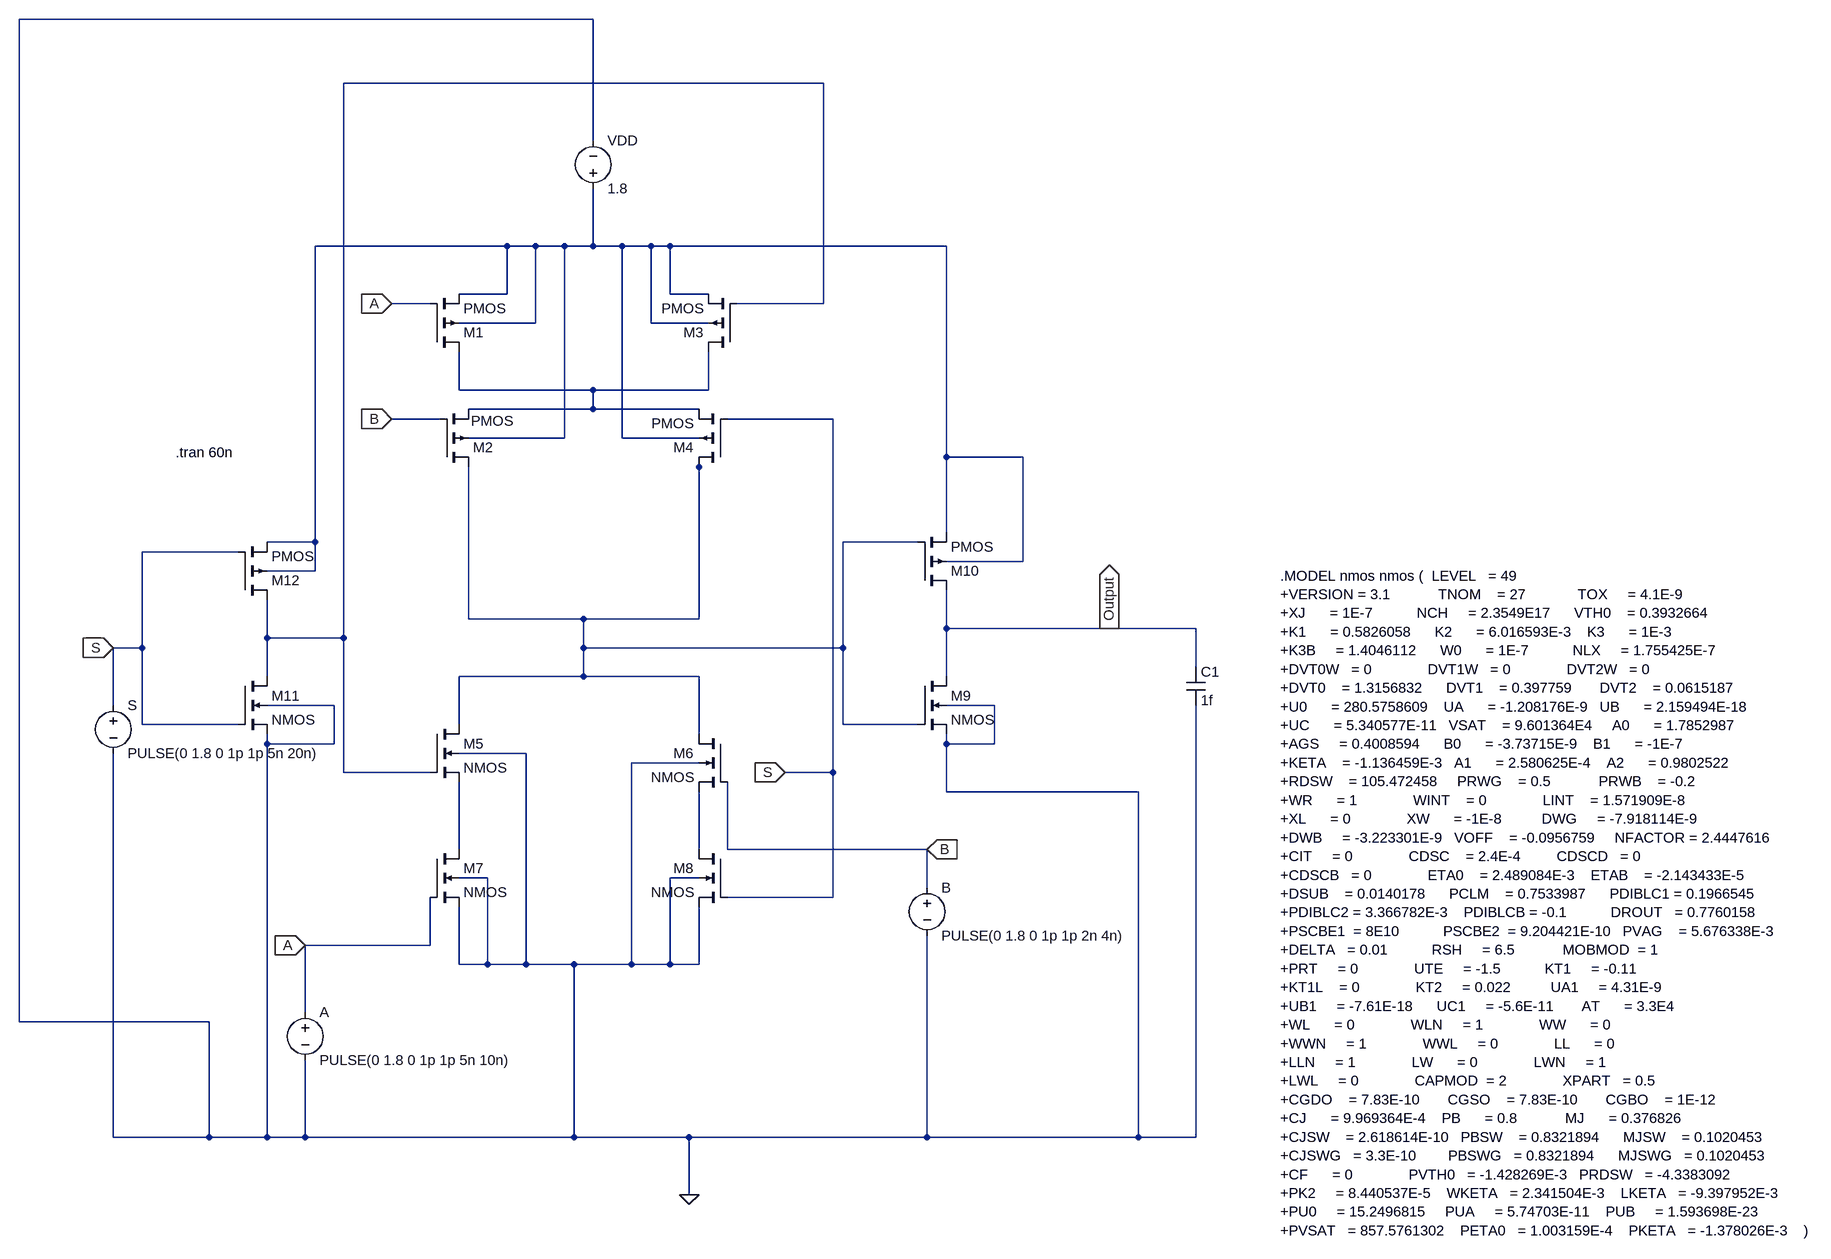
[diagram p0: schematic 2x1 MUX.asc]
2x1 MUX.asc, the LTspice schematic file:
Version 4
SHEET 1 2604 1684
WIRE 272 -336 -800 -336
WIRE 656 -208 -144 -208
WIRE 272 -112 272 -336
WIRE 128 64 -192 64
WIRE 176 64 128 64
WIRE 224 64 176 64
WIRE 272 64 272 -32
WIRE 272 64 224 64
WIRE 320 64 272 64
WIRE 368 64 320 64
WIRE 400 64 368 64
WIRE 864 64 400 64
WIRE 128 144 128 64
WIRE 128 144 48 144
WIRE 400 144 400 64
WIRE 464 144 400 144
WIRE 0 160 -64 160
WIRE 656 160 656 -208
WIRE 656 160 512 160
WIRE 176 192 176 64
WIRE 176 192 48 192
WIRE 368 192 368 64
WIRE 464 192 368 192
WIRE 48 304 48 240
WIRE 272 304 48 304
WIRE 464 304 464 240
WIRE 464 304 272 304
WIRE 272 336 272 304
WIRE 272 336 64 336
WIRE 448 336 272 336
WIRE 16 352 -64 352
WIRE 672 352 496 352
WIRE 224 384 224 64
WIRE 224 384 64 384
WIRE 320 384 320 64
WIRE 448 384 320 384
WIRE 864 416 864 64
WIRE 992 416 864 416
WIRE 448 432 448 416
WIRE 864 560 864 416
WIRE -192 576 -192 64
WIRE -192 576 -272 576
WIRE 816 576 688 576
WIRE -320 592 -480 592
WIRE 992 608 992 416
WIRE 992 608 864 608
WIRE -192 624 -192 576
WIRE -192 624 -272 624
WIRE 64 704 64 432
WIRE 256 704 64 704
WIRE 448 704 448 432
WIRE 448 704 256 704
WIRE 864 720 864 656
WIRE 1136 720 864 720
WIRE 1280 720 1136 720
WIRE -272 736 -272 672
WIRE -144 736 -144 -208
WIRE -144 736 -272 736
WIRE -480 752 -480 592
WIRE -480 752 -528 752
WIRE 256 752 256 704
WIRE 688 752 688 576
WIRE 688 752 256 752
WIRE 1280 784 1280 720
WIRE -272 800 -272 736
WIRE 256 800 256 752
WIRE 256 800 48 800
WIRE 448 800 256 800
WIRE 864 800 864 720
WIRE -528 848 -528 752
WIRE -160 848 -272 848
WIRE 944 848 864 848
WIRE -480 880 -480 752
WIRE -320 880 -480 880
WIRE 48 880 48 800
WIRE 688 880 688 752
WIRE 816 880 688 880
WIRE 448 896 448 800
WIRE -272 912 -272 896
WIRE -160 912 -160 848
WIRE -160 912 -272 912
WIRE 864 912 864 896
WIRE 944 912 944 848
WIRE 944 912 864 912
WIRE 160 928 48 928
WIRE 448 944 336 944
WIRE -144 960 -144 736
WIRE 0 960 -144 960
WIRE 672 960 672 352
WIRE 672 960 592 960
WIRE 864 992 864 912
WIRE 1184 992 864 992
WIRE 48 1088 48 976
WIRE 448 1088 448 992
WIRE 496 1088 496 976
WIRE 832 1088 496 1088
WIRE 96 1136 48 1136
WIRE 448 1136 400 1136
WIRE 832 1152 832 1088
WIRE 672 1168 672 960
WIRE 672 1168 496 1168
WIRE 0 1248 0 1168
WIRE 0 1248 -208 1248
WIRE 48 1280 48 1184
WIRE 96 1280 96 1136
WIRE 96 1280 48 1280
WIRE 160 1280 160 928
WIRE 160 1280 96 1280
WIRE 240 1280 160 1280
WIRE 336 1280 336 944
WIRE 336 1280 240 1280
WIRE 400 1280 400 1136
WIRE 400 1280 336 1280
WIRE 448 1280 448 1184
WIRE 448 1280 400 1280
WIRE -208 1360 -208 1248
WIRE -800 1376 -800 -336
WIRE -368 1376 -800 1376
WIRE -528 1568 -528 928
WIRE -368 1568 -368 1376
WIRE -368 1568 -528 1568
WIRE -272 1568 -272 912
WIRE -272 1568 -368 1568
WIRE -208 1568 -208 1440
WIRE -208 1568 -272 1568
WIRE 240 1568 240 1280
WIRE 240 1568 -208 1568
WIRE 432 1568 240 1568
WIRE 832 1568 832 1232
WIRE 832 1568 432 1568
WIRE 1184 1568 1184 992
WIRE 1184 1568 832 1568
WIRE 1280 1568 1280 848
WIRE 1280 1568 1184 1568
WIRE 432 1664 432 1568
FLAG -64 352 B
IOPIN -64 352 In
FLAG -64 160 A
IOPIN -64 160 In
FLAG -528 752 S
IOPIN -528 752 In
FLAG 592 960 S
IOPIN 592 960 In
FLAG 832 1088 B
IOPIN 832 1088 In
FLAG 1136 720 Output
IOPIN 1136 720 Out
FLAG -208 1248 A
IOPIN -208 1248 In
FLAG 432 1664 0
SYMBOL voltage 272 -16 M180
WINDOW 0 24 96 Left 2
WINDOW 3 24 16 Left 2
WINDOW 123 0 0 Left 0
WINDOW 39 0 0 Left 0
SYMATTR InstName VDD
SYMATTR Value 1.8
SYMBOL pmos4 0 240 M180
SYMATTR InstName M1
SYMATTR Value2 l=180n w=360n
SYMBOL pmos4 512 240 R180
SYMATTR InstName M3
SYMATTR Value2 l=180n w=360n
SYMBOL pmos4 16 432 M180
WINDOW 3 52 76 Left 2
SYMATTR InstName M2
SYMATTR Value2 l=180n w=360n
SYMBOL pmos4 496 432 R180
SYMATTR InstName M4
SYMATTR Value2 l=180n w=360n
SYMBOL nmos4 0 880 R0
SYMATTR InstName M5
SYMATTR Value2 l=180n w=360n
SYMBOL nmos4 496 896 M0
SYMATTR InstName M6
SYMATTR Value2 l=180n w=360n
SYMBOL nmos4 0 1088 R0
SYMATTR InstName M7
SYMATTR Value2 l=180n w=360n
SYMBOL nmos4 496 1088 M0
SYMATTR InstName M8
SYMATTR Value2 l=180n w=360n
SYMBOL nmos4 816 800 R0
SYMATTR InstName M9
SYMATTR Value2 l=180n w=360n
SYMBOL pmos4 816 656 M180
SYMATTR InstName M10
SYMATTR Value2 l=180n w=360n
SYMBOL pmos4 -320 672 M180
SYMATTR InstName M12
SYMATTR Value2 l=180n w=360n
SYMBOL nmos4 -320 800 R0
SYMATTR InstName M11
SYMATTR Value2 l=180n w=360n
SYMBOL voltage 832 1136 R0
WINDOW 123 0 0 Left 0
WINDOW 39 0 0 Left 0
SYMATTR InstName B
SYMATTR Value PULSE(0 1.8 0 1p 1p 2n 4n)
SYMBOL voltage -528 832 R0
WINDOW 123 0 0 Left 0
WINDOW 39 0 0 Left 0
SYMATTR InstName S
SYMATTR Value PULSE(0 1.8 0 1p 1p 5n 20n)
SYMBOL voltage -208 1344 R0
WINDOW 123 0 0 Left 0
WINDOW 39 0 0 Left 0
SYMATTR InstName A
SYMATTR Value PULSE(0 1.8 0 1p 1p 5n 10n)
SYMBOL cap 1264 784 R0
SYMATTR InstName C1
SYMATTR Value 1f
TEXT -424 408 Left 2 !.tran 60n
TEXT 1664 632 Left 2 !.MODEL nmos nmos (  LEVEL   = 49\n+VERSION = 3.1            TNOM    = 27             TOX     = 4.1E-9\n+XJ      = 1E-7           NCH     = 2.3549E17      VTH0    = 0.3932664\n+K1      = 0.5826058      K2      = 6.016593E-3    K3      = 1E-3\n+K3B     = 1.4046112      W0      = 1E-7           NLX     = 1.755425E-7\n+DVT0W   = 0              DVT1W   = 0              DVT2W   = 0\n+DVT0    = 1.3156832      DVT1    = 0.397759       DVT2    = 0.0615187\n+U0      = 280.5758609    UA      = -1.208176E-9   UB      = 2.159494E-18\n+UC      = 5.340577E-11   VSAT    = 9.601364E4     A0      = 1.7852987\n+AGS     = 0.4008594      B0      = -3.73715E-9    B1      = -1E-7\n+KETA    = -1.136459E-3   A1      = 2.580625E-4    A2      = 0.9802522\n+RDSW    = 105.472458     PRWG    = 0.5            PRWB    = -0.2\n+WR      = 1              WINT    = 0              LINT    = 1.571909E-8\n+XL      = 0              XW      = -1E-8          DWG     = -7.918114E-9\n+DWB     = -3.223301E-9   VOFF    = -0.0956759     NFACTOR = 2.4447616\n+CIT     = 0              CDSC    = 2.4E-4         CDSCD   = 0\n+CDSCB   = 0              ETA0    = 2.489084E-3    ETAB    = -2.143433E-5\n+DSUB    = 0.0140178      PCLM    = 0.7533987      PDIBLC1 = 0.1966545\n+PDIBLC2 = 3.366782E-3    PDIBLCB = -0.1           DROUT   = 0.7760158\n+PSCBE1  = 8E10           PSCBE2  = 9.204421E-10   PVAG    = 5.676338E-3\n+DELTA   = 0.01           RSH     = 6.5            MOBMOD  = 1\n+PRT     = 0              UTE     = -1.5           KT1     = -0.11\n+KT1L    = 0              KT2     = 0.022          UA1     = 4.31E-9\n+UB1     = -7.61E-18      UC1     = -5.6E-11       AT      = 3.3E4\n+WL      = 0              WLN     = 1              WW      = 0\n+WWN     = 1              WWL     = 0              LL      = 0\n+LLN     = 1              LW      = 0              LWN     = 1\n+LWL     = 0              CAPMOD  = 2              XPART   = 0.5\n+CGDO    = 7.83E-10       CGSO    = 7.83E-10       CGBO    = 1E-12\n+CJ      = 9.969364E-4    PB      = 0.8            MJ      = 0.376826\n+CJSW    = 2.618614E-10   PBSW    = 0.8321894      MJSW    = 0.1020453\n+CJSWG   = 3.3E-10        PBSWG   = 0.8321894      MJSWG   = 0.1020453\n+CF      = 0              PVTH0   = -1.428269E-3   PRDSW   = -4.3383092\n+PK2     = 8.440537E-5    WKETA   = 2.341504E-3    LKETA   = -9.397952E-3\n+PU0     = 15.2496815     PUA     = 5.74703E-11    PUB     = 1.593698E-23\n+PVSAT   = 857.5761302    PETA0   = 1.003159E-4    PKETA   = -1.378026E-3    )

The netlist it stands for:
* 2x1 MUX.asc
VDD N002 0 1.8
M1 N003 A N002 N002 PMOS l=180n w=360n
M3 N003 N001 N002 N002 PMOS l=180n w=360n
M2 N004 B N003 N002 PMOS l=180n w=360n
M4 N004 S N003 N002 PMOS l=180n w=360n
M5 N004 N001 N005 0 NMOS l=180n w=360n
M6 N004 B N006 0 NMOS l=180n w=360n
M7 N005 A 0 0 NMOS l=180n w=360n
M8 N006 S 0 0 NMOS l=180n w=360n
M9 Output N004 0 0 NMOS l=180n w=360n
M10 Output N004 N002 N002 PMOS l=180n w=360n
M12 N001 S N002 N002 PMOS l=180n w=360n
M11 N001 S 0 0 NMOS l=180n w=360n
V§B B 0 PULSE(0 1.8 0 1p 1p 2n 4n)
V§S S 0 PULSE(0 1.8 0 1p 1p 5n 20n)
V§A A 0 PULSE(0 1.8 0 1p 1p 5n 10n)
C1 Output 0 1f
.model NMOS NMOS
.model PMOS PMOS
.lib standard.mos
.tran 60n
.MODEL nmos nmos (  LEVEL   = 49
+VERSION = 3.1            TNOM    = 27             TOX     = 4.1E-9
+XJ      = 1E-7           NCH     = 2.3549E17      VTH0    = 0.3932664
+K1      = 0.5826058      K2      = 6.016593E-3    K3      = 1E-3
+K3B     = 1.4046112      W0      = 1E-7           NLX     = 1.755425E-7
+DVT0W   = 0              DVT1W   = 0              DVT2W   = 0
+DVT0    = 1.3156832      DVT1    = 0.397759       DVT2    = 0.0615187
+U0      = 280.5758609    UA      = -1.208176E-9   UB      = 2.159494E-18
+UC      = 5.340577E-11   VSAT    = 9.601364E4     A0      = 1.7852987
+AGS     = 0.4008594      B0      = -3.73715E-9    B1      = -1E-7
+KETA    = -1.136459E-3   A1      = 2.580625E-4    A2      = 0.9802522
+RDSW    = 105.472458     PRWG    = 0.5            PRWB    = -0.2
+WR      = 1              WINT    = 0              LINT    = 1.571909E-8
+XL      = 0              XW      = -1E-8          DWG     = -7.918114E-9
+DWB     = -3.223301E-9   VOFF    = -0.0956759     NFACTOR = 2.4447616
+CIT     = 0              CDSC    = 2.4E-4         CDSCD   = 0
+CDSCB   = 0              ETA0    = 2.489084E-3    ETAB    = -2.143433E-5
+DSUB    = 0.0140178      PCLM    = 0.7533987      PDIBLC1 = 0.1966545
+PDIBLC2 = 3.366782E-3    PDIBLCB = -0.1           DROUT   = 0.7760158
+PSCBE1  = 8E10           PSCBE2  = 9.204421E-10   PVAG    = 5.676338E-3
+DELTA   = 0.01           RSH     = 6.5            MOBMOD  = 1
+PRT     = 0              UTE     = -1.5           KT1     = -0.11
+KT1L    = 0              KT2     = 0.022          UA1     = 4.31E-9
+UB1     = -7.61E-18      UC1     = -5.6E-11       AT      = 3.3E4
+WL      = 0              WLN     = 1              WW      = 0
+WWN     = 1              WWL     = 0              LL      = 0
+LLN     = 1              LW      = 0              LWN     = 1
+LWL     = 0              CAPMOD  = 2              XPART   = 0.5
+CGDO    = 7.83E-10       CGSO    = 7.83E-10       CGBO    = 1E-12
+CJ      = 9.969364E-4    PB      = 0.8            MJ      = 0.376826
+CJSW    = 2.618614E-10   PBSW    = 0.8321894      MJSW    = 0.1020453
+CJSWG   = 3.3E-10        PBSWG   = 0.8321894      MJSWG   = 0.1020453
+CF      = 0              PVTH0   = -1.428269E-3   PRDSW   = -4.3383092
+PK2     = 8.440537E-5    WKETA   = 2.341504E-3    LKETA   = -9.397952E-3
+PU0     = 15.2496815     PUA     = 5.74703E-11    PUB     = 1.593698E-23
+PVSAT   = 857.5761302    PETA0   = 1.003159E-4    PKETA   = -1.378026E-3    )
.backanno
.end